# EAGLE design SECDONGL_001 (EAGLE 7.7.0)

## Sheet 1 of 3
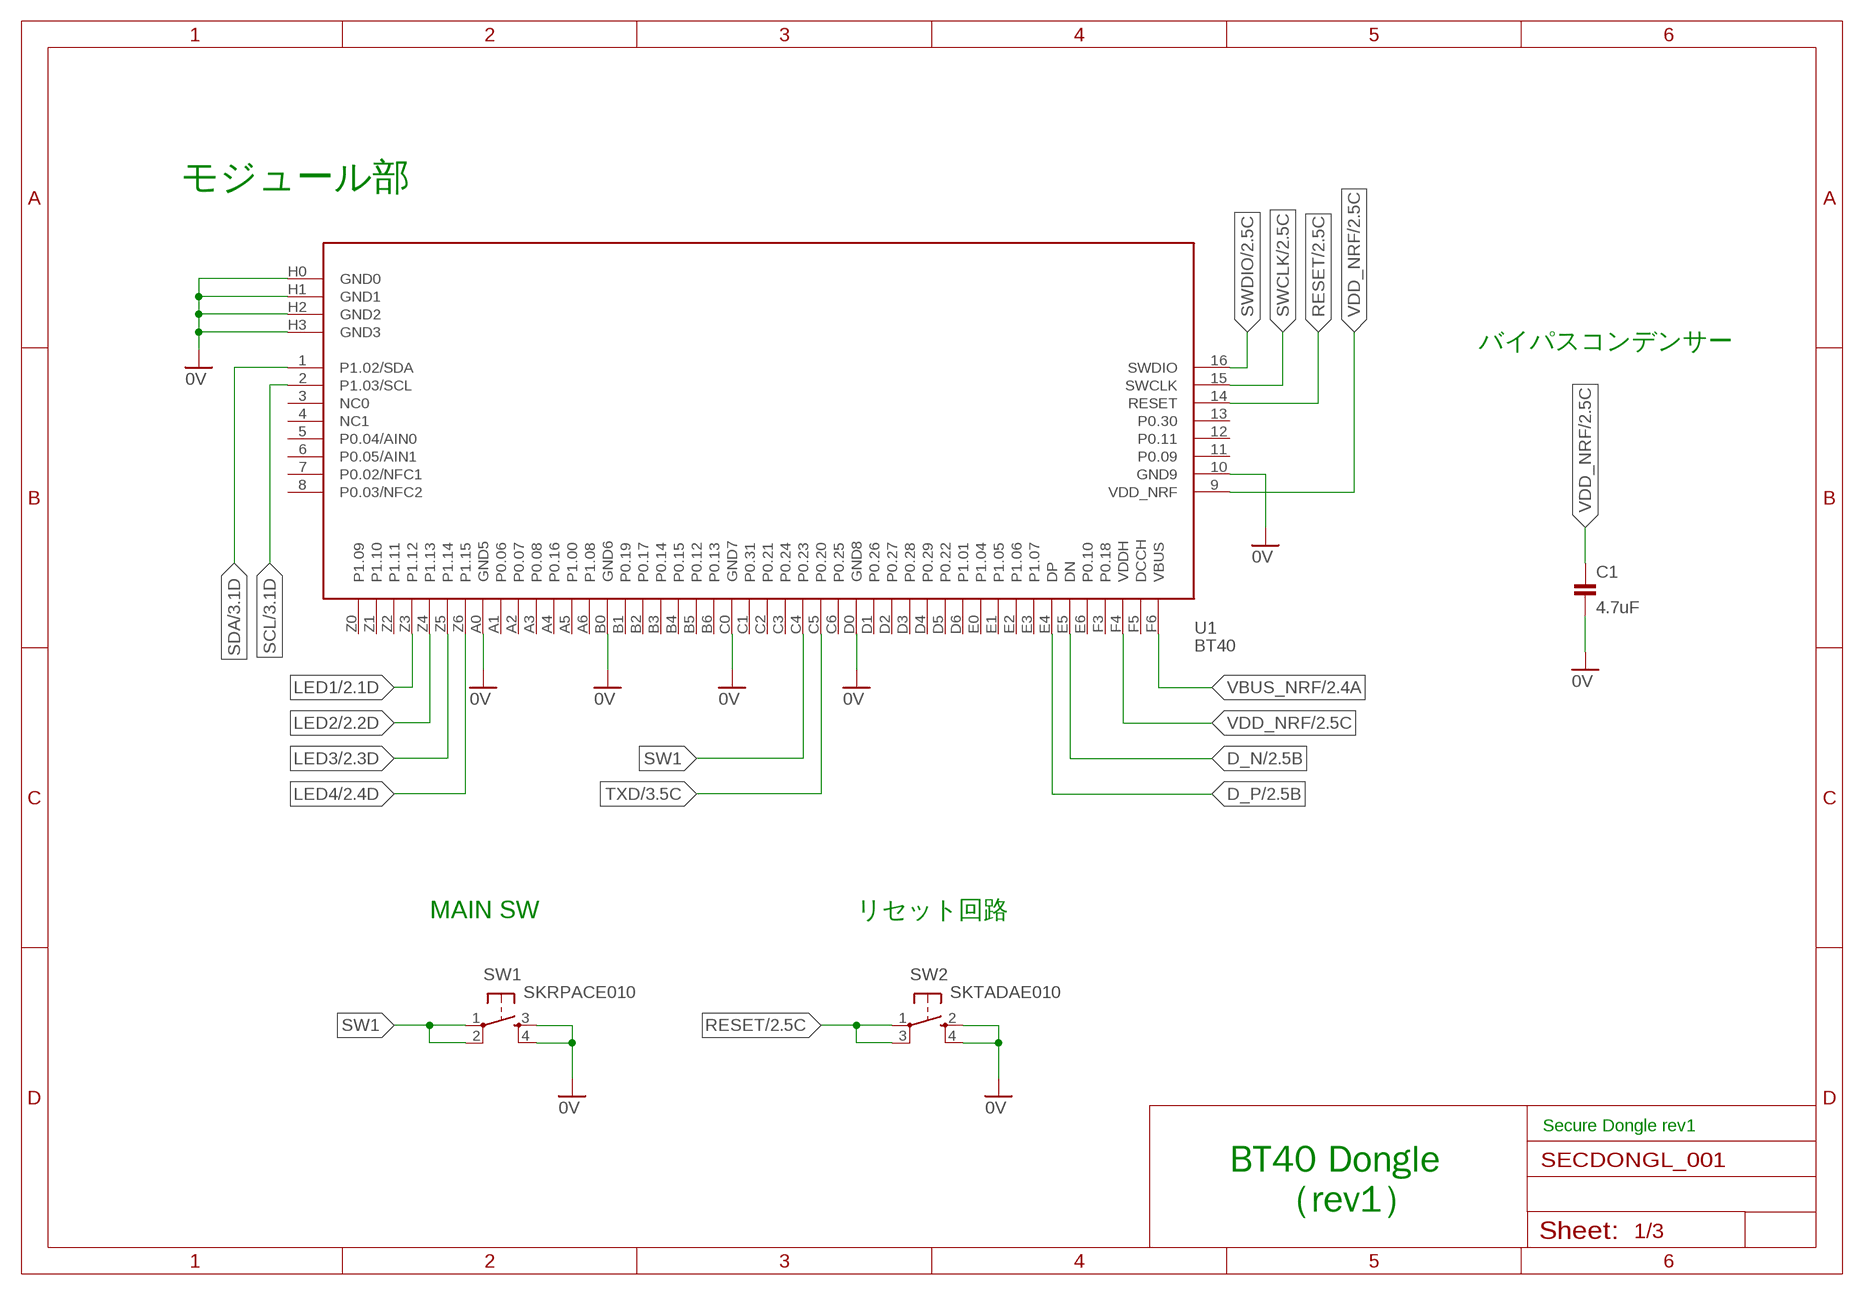
[diagram p0: schematic, sheet 1]

### Parts
C1  4.7uF  CAP_0603  [C0603K]
SW1  SKRPACE010  [SKRPACE010]
SW2  SKTADAE010  [SKTADAE010]
U1  BT40  [BM40-B_1PRIMARY]

### Nets
0V: C1.2 SW1.3(S) SW1.4(S1) SW2.2(S) SW2.4(S1) U1.10(GND9) U1.A0(GND5) U1.B0(GND6) U1.C0(GND7) U1.D0(GND8) U1.H0(GND0) U1.H1(GND1) U1.H2(GND2) U1.H3(GND3) ; also sheet 2,3
D_N: U1.E5(DN) ; also sheet 2
D_P: U1.E4(DP) ; also sheet 2
LED1: U1.Z3(P1.12) ; also sheet 2
LED2: U1.Z4(P1.13) ; also sheet 2
LED3: U1.Z5(P1.14) ; also sheet 2
LED4: U1.Z6(P1.15) ; also sheet 2
RESET: SW2.1(P) SW2.3(P1) U1.14(RESET) ; also sheet 2
SCL: U1.2(P1.03/SCL) ; also sheet 3
SDA: U1.1(P1.02/SDA) ; also sheet 3
SW1: SW1.1(P) SW1.2(P1) U1.C4(P0.23)
SWCLK: U1.15(SWCLK) ; also sheet 2
SWDIO: U1.16(SWDIO) ; also sheet 2
TXD: U1.C5(P0.20) ; also sheet 3
VBUS_NRF: U1.F6(VBUS) ; also sheet 2,3
VDD_NRF: C1.1 U1.9(VDD_NRF) U1.F4(VDDH) ; also sheet 2,3
Unconnected: U1.3(NC0) U1.4(NC1) U1.5(P0.04/AIN0) U1.6(P0.05/AIN1) U1.7(P0.02/NFC1) U1.8(P0.03/NFC2) U1.11(P0.09) U1.12(P0.11) U1.13(P0.30) U1.A1(P0.06) U1.A2(P0.07) U1.A3(P0.08) U1.A4(P0.16) U1.A5(P1.00) U1.A6(P1.08) U1.B1(P0.19) U1.B2(P0.17) U1.B3(P0.14) U1.B4(P0.15) U1.B5(P0.12) U1.B6(P0.13) U1.C1(P0.31) U1.C2(P0.21) U1.C3(P0.24) U1.C6(P0.25) U1.D1(P0.26) U1.D2(P0.27) U1.D3(P0.28) U1.D4(P0.29) U1.D5(P0.22) U1.D6(P1.01) U1.E0(P1.04) U1.E1(P1.05) U1.E2(P1.06) U1.E3(P1.07) U1.E6(P0.10) U1.F3(P0.18) U1.F5(DCCH) U1.Z0(P1.09) U1.Z1(P1.10) U1.Z2(P1.11)

### Notes on the sheet
- モジュール部
- バイパスコンデンサー
- MAIN SW | リセット回路
- Secure Dongle rev1
- BT40 Dongle
      （rev1）

## Sheet 2 of 3
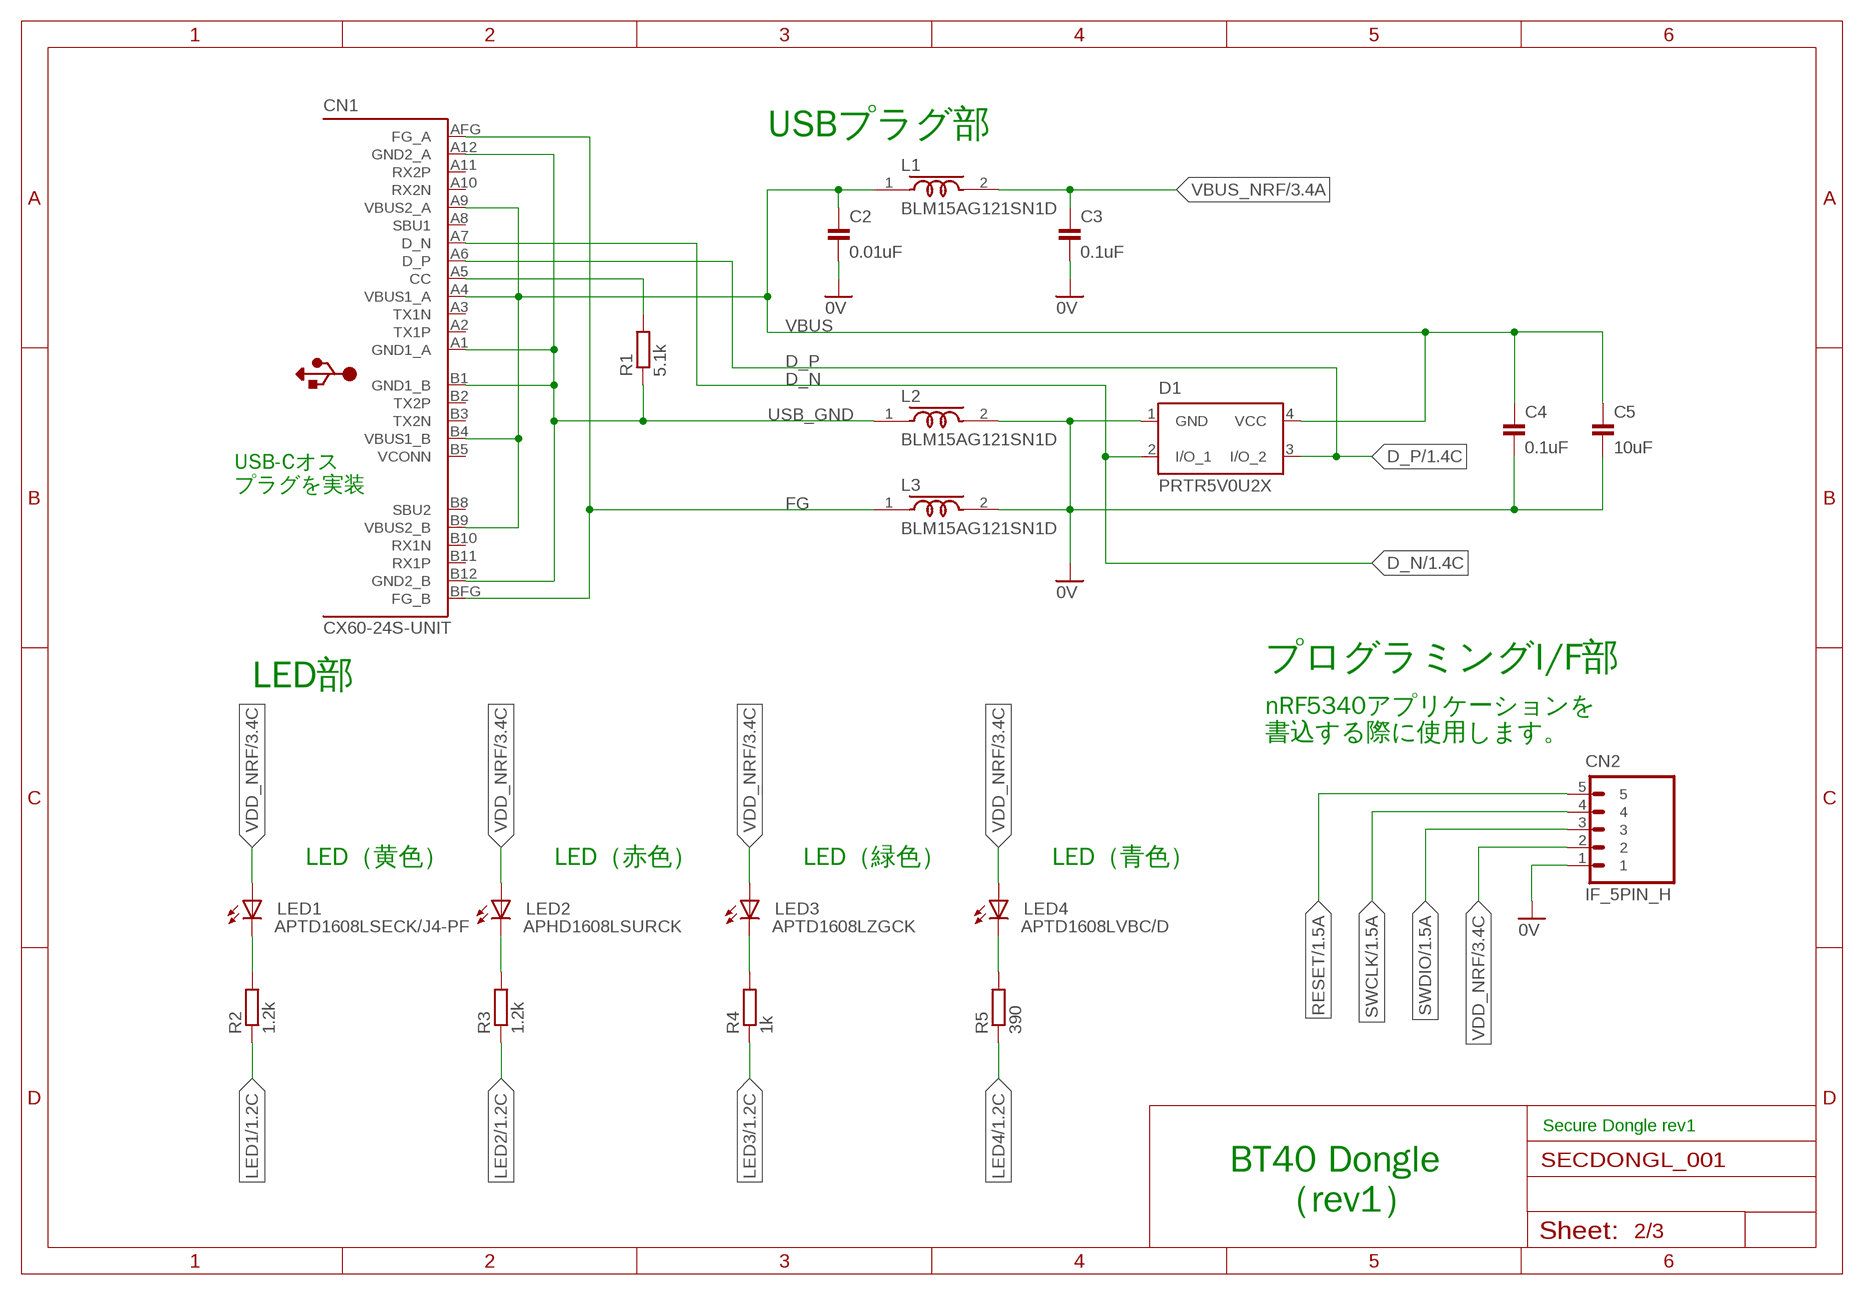
[diagram p1: schematic, sheet 2]

### Parts
C2  0.01uF  CAP_0402K  [C0402K]
C3  0.1uF  CAP_0402K  [C0402K]
C4  0.1uF  CAP_0402K  [C0402K]
C5  10uF  CAP_0603  [C0603K]
CN1  CX60-24S-UNIT  [CX60-24S-UNIT]
CN2  IF_5PIN_H  [HEADER_5PIN]
D1  PRTR5V0U2X  [SOT143B]
L1  BLM15AG121SN1D  [C0402K]
L2  BLM15AG121SN1D  [C0402K]
L3  BLM15AG121SN1D  [C0402K]
LED1  APTD1608LSECK/J4-PF  [APTD1608]
LED2  APHD1608LSURCK  [APTD1608]
LED3  APTD1608LZGCK  [APTD1608]
LED4  APTD1608LVBC/D  [APTD1608]
R1  5.1k  RESISTOR_0402  [R0402]
R2  1.2k  RESISTOR_0402  [R0402]
R3  1.2k  RESISTOR_0402  [R0402]
R4  1k  RESISTOR_0402  [R0402]
R5  390  RESISTOR_0402  [R0402]

### Nets
0V: C2.2 C3.2 C4.2 C5.2 CN2.1 D1.1(GND) L2.2 L3.2 ; also sheet 1,3
D_N: CN1.A7(D_N) D1.2(I/O_1) ; also sheet 1
D_P: CN1.A6(D_P) D1.3(I/O_2) ; also sheet 1
FG: CN1.AFG(FG_A) CN1.BFG(FG_B) L3.1
LED1: R2.1 ; also sheet 1
LED2: R3.1 ; also sheet 1
LED3: R4.1 ; also sheet 1
LED4: R5.1 ; also sheet 1
N$1: LED4.C R5.2
N$2: CN1.A5(CC) R1.2
N$6: LED3.C R4.2
N$7: LED2.C R3.2
N$8: LED1.C R2.2
RESET: CN2.5 ; also sheet 1
SWCLK: CN2.4 ; also sheet 1
SWDIO: CN2.3 ; also sheet 1
USB_GND: CN1.A1(GND1_A) CN1.A12(GND2_A) CN1.B1(GND1_B) CN1.B12(GND2_B) L2.1 R1.1
VBUS: C2.1 C4.1 C5.1 CN1.A4(VBUS1_A) CN1.A9(VBUS2_A) CN1.B4(VBUS1_B) CN1.B9(VBUS2_B) D1.4(VCC) L1.1
VBUS_NRF: C3.1 L1.2 ; also sheet 1,3
VDD_NRF: CN2.2 LED1.A LED2.A LED3.A LED4.A ; also sheet 1,3
Unconnected: CN1.A2(TX1P) CN1.A3(TX1N) CN1.A8(SBU1) CN1.A10(RX2N) CN1.A11(RX2P) CN1.B2(TX2P) CN1.B3(TX2N) CN1.B5(VCONN) CN1.B8(SBU2) CN1.B10(RX1N) CN1.B11(RX1P)

### Notes on the sheet
- USBプラグ部
- USB-Cオス
  プラグを実装
- プログラミングI/F部
- LED部
- nRF5340アプリケーションを
  書込する際に使用します。
- LED（黄色） | LED（赤色） | LED（緑色） | LED（青色）
- Secure Dongle rev1
- BT40 Dongle
      （rev1）

## Sheet 3 of 3
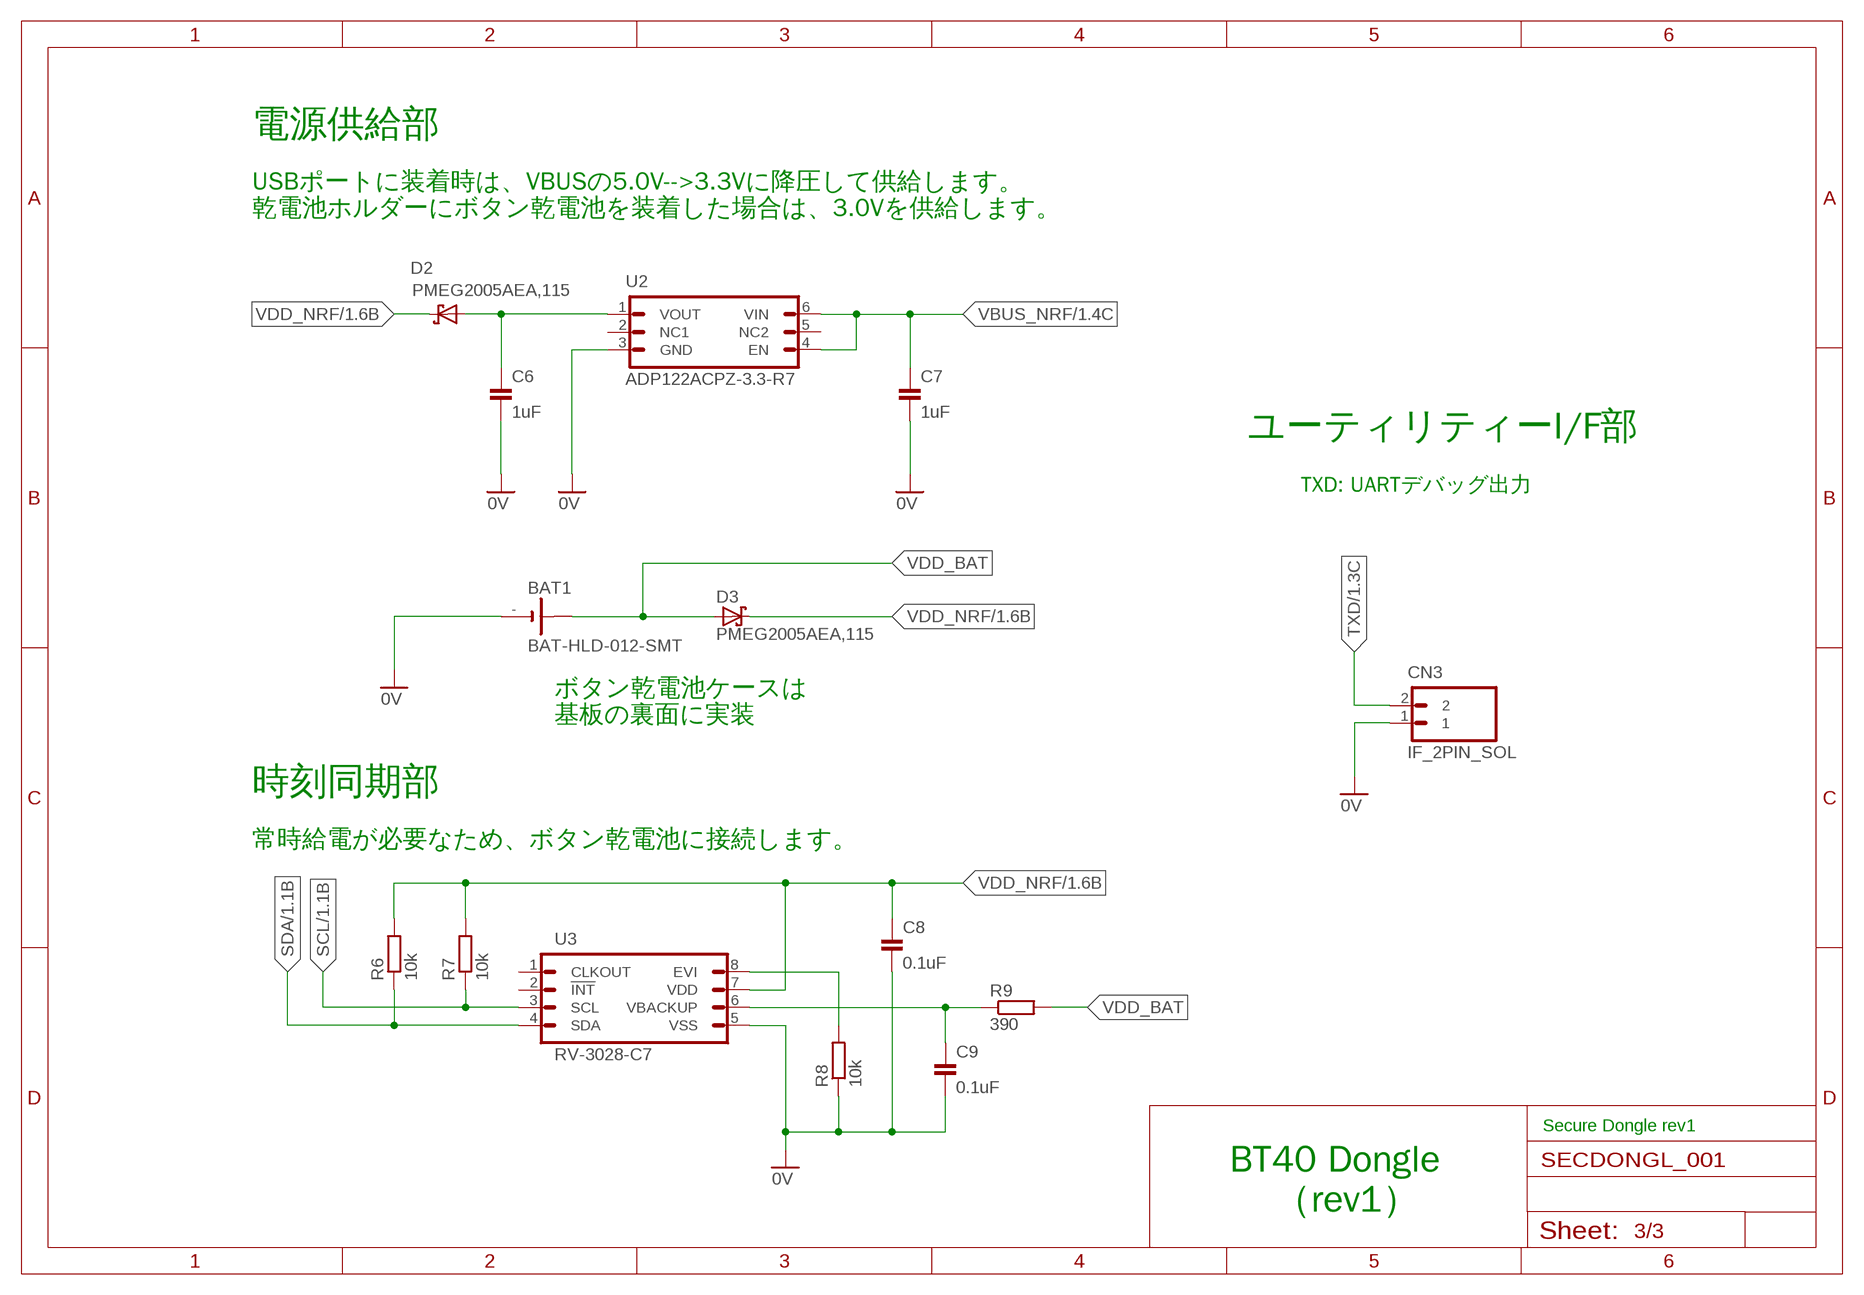
[diagram p2: schematic, sheet 3]

### Parts
BAT1  BAT-HLD-012-SMT  [BAT-HLD-012-SMT]
C6  1uF  CAP_0603  [C0603K]
C7  1uF  CAP_0603  [C0603K]
C8  0.1uF  CAP_0402K  [C0402K]
C9  0.1uF  CAP_0402K  [C0402K]
CN3  IF_2PIN_SOL  [SOLPAD_2PIN]
D2  PMEG2005AEA,115  [SOD323-W]
D3  PMEG2005AEA,115  [SOD323-W]
R6  10k  RESISTOR_0402  [R0402]
R7  10k  RESISTOR_0402  [R0402]
R8  10k  RESISTOR_0402  [R0402]
R9  390  RESISTOR_0402  [R0402]
U2  ADP122ACPZ-3.3-R7  [6-LFCSP_UD]
U3  RV-3028-C7  [SON-8]

### Nets
0V: BAT1.- C6.2 C7.2 C8.2 C9.2 CN3.1 R8.1 U2.3(GND) U3.5(VSS) ; also sheet 1,2
N$3: C6.1 D2.A U2.1(VOUT)
N$4: C9.1 R9.1 U3.6(VBACKUP)
N$5: R8.2 U3.8(EVI)
SCL: R7.1 U3.3(SCL) ; also sheet 1
SDA: R6.1 U3.4(SDA) ; also sheet 1
TXD: CN3.2 ; also sheet 1
VBUS_NRF: C7.1 U2.4(EN) U2.6(VIN) ; also sheet 1,2
VDD_BAT: BAT1.+@2(+) D3.A R9.2
VDD_NRF: C8.1 D2.C D3.C R6.2 R7.2 U3.7(VDD) ; also sheet 1,2
Unconnected: U2.2(NC1) U2.5(NC2) U3.1(CLKOUT) U3.2(!INT!)

### Notes on the sheet
- 電源供給部
- USBポートに装着時は、VBUSの5.0V-->3.3Vに降圧して供給します。
  乾電池ホルダーにボタン乾電池を装着した場合は、3.0Vを供給します。
- ユーティリティーI/F部
- TXD: UARTデバッグ出力
- ボタン乾電池ケースは
  基板の裏面に実装
- 時刻同期部
- 常時給電が必要なため、ボタン乾電池に接続します。
- Secure Dongle rev1
- BT40 Dongle
      （rev1）

## Library data of the parts
BAT1 = Connectors:BAT-HLD-012-SMT: ボタン電池ホルダー(CR1216/1225)
C1-C9 = Parts:CAP: コンデンサー
CN1 = Connectors:CX60-24S-UNIT: USB Type-C(TM) plug
CN2 = Connectors:IF_5PIN: 5-pin インターフェース
CN3 = Connectors:IF_2PIN: 2-pin インターフェース
D1 = Parts:PRTR5V0U2X: ESD protection diode
D2 D3 = Parts:PMEG2005: ショットキーダイオード If - 順電流: 500 mA Vrrm - 繰返し逆電圧: 20 V Vf - 順電圧: 0.39 V Ifsm - 順方向サージ電流: 10 A 最低動作温度: - 65 C 最高動作温度: + 150 C
L1-L3 = Parts:BLM15AG: フェライトビーズ EMIFIL®
LED1 LED3 LED4 = Parts:APTD1608: 発光ダイオード
LED2 = Parts:APHD1608: 発光ダイオード
R1-R9 = Parts:RESISTOR: 抵抗器
SW1 = Parts:SKRPACE010: 表面実装用タクトスイッチ ４．２×３．２ｍｍ小型重作動力タイプ ・作動力：２．５５Ｎ ・操作方向：垂直 ・移動量：０．２ｍｍ ・動作寿命：５０，０００ｃｙｃｌｅｓ （５ｍＡ ５ＶＤＣ） ・初期接触抵抗：最大５００ｍΩ
SW2 = Parts:SKTADAE010: 表面実装用タクトスイッチ 2.6×1.6ｍｍ小型重作動力タイプ ・作動力：2.4 N ・操作方向：垂直 ・移動量：0.11 mm ・定格：50 mA 12 VDC
U1 = Modules:BT40: BLE 5.2, 802.15.4 Modules ・nRF5340 QKAA, dual core ARM® Cortex M33 ・128/64 MHz Cortex M33 with FPU and DSP instructions ・1MB flash, 512KB RAM ・DC-DC converter, inductors for VDD, VDDH on board. ・Direct powered by Lithium batteries or USB supply (up to 5.5V)
U2 = ICs:ADP122: Low Quiescent Current, CMOS Linear Regulator Input voltage supply range: 2.3 V to 5.5 V 300 mA maximum output current Very low dropout voltage: 85 mV at 300 mA load Low quiescent current: 45 μA at no load
U3 = ICs:RV-3028-C7: Extreme Low Power RTC Module Supply Voltage: 1.2 V 〜 5.5 V Operating Temperature: - 40 C 〜 + 85 C 3.2 mm x 1.5 mm

## Board
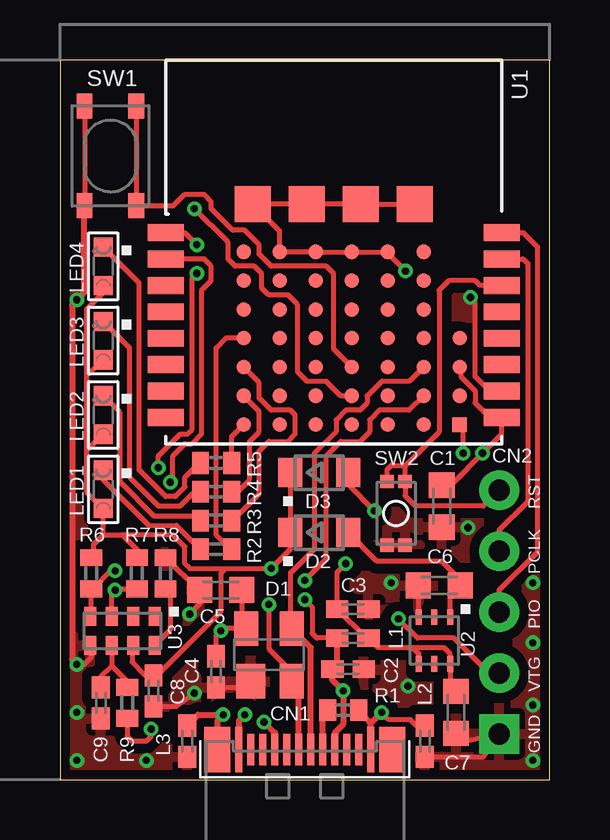
[diagram p3: board, top side]
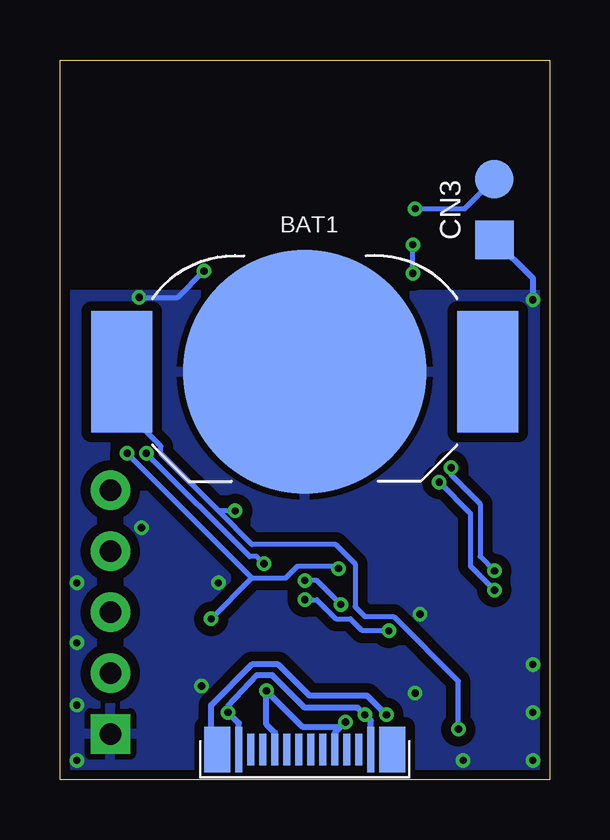
[diagram p4: board, bottom side, seen from below]

Size 20.4 x 30 mm. Coordinates in mm from the lower left corner, seen from the top.
Outline: 0,0 20.4,0 20.4,30 0,30 0,0
Copper layers (1*16): Top 0.035mm / dielectric 1.5mm / Bottom 0.035mm
Design rules "SeeedStudio_2layer_DRU_no_angle_20140221 *": minimum track width 6mil, minimum drill 0.3mm, track to track 6mil, track to pad 6mil, pad to pad 6mil, via to via 6mil, smd to smd 0mil, copper to edge 10mil, drill to drill 10mil, minimum pad ring 10mil, minimum via ring 6mil, stop-mask expansion 2mil, vias tented up to drill 100mil, thermal gap 10mil

### Footprints (pad centres in the part's own frame; a part is rotated, then mirrored left to right if it is on the bottom)
BAT-HLD-012-SMT = smd 2.54 x 5.08: +@1 -7.62,0; +@2 7.62,0 | smd 10.16 x 10.16: - 0,0
C0603K = smd 1.05 x 1.08: 1 -0.875,0; 2 0.875,0
C0402K = smd 0.925 x 0.74: 1 -0.65,0; 2 0.65,0
CX60-24S-UNIT = smd 0.28 x 1.9: A1 2.75,0; A12 -2.75,0 | smd 0.28 x 1.3: A2 2.25,0; A3 1.75,0; A4 1.25,0; A5 0.75,0; A6 0.25,0; A7 -0.25,0; A8 -0.75,0; A9 -1.25,0; A10 -1.75,0; A11 -2.25,0 | smd 1.08 x 1.9: ADUM 3.64,0; AFG -3.64,0 | smd 0.28 x 1.9 bottom: B1 -2.75,0; B12 2.75,0 | smd 0.28 x 1.3 bottom: B2 -2.25,0; B3 -1.75,0; B4 -1.25,0; B5 -0.75,0; B6 -0.25,0; B7 0.25,0; B8 0.75,0; B9 1.25,0; B10 1.75,0; B11 2.25,0 | smd 1.08 x 1.9 bottom: BDUM -3.64,0; BFG 3.64,0
HEADER_5PIN = drill 0.889 pad 1.651 square: 1 0,0 | drill 0.889 pad 1.651: 2 2.54,0; 3 5.08,0; 4 7.62,0; 5 10.16,0
SOLPAD_2PIN = smd 1.6 x 1.6: 1 0,0; 2 2.54,0
SOT143B = smd 1.2 x 1.44: 1 -0.75,-1.1 | smd 1 x 1.44: 2 0.95,-1.1; 3 0.95,1.1; 4 -0.95,1.1
SOD323-W = smd 1 x 1.2: A 1.2,0; C -1.2,0
APTD1608 = smd 0.8 x 0.8: A -0.8,0; C 0.8,0
R0402 = smd 0.7 x 0.9: 1 -0.65,0; 2 0.65,0
SKRPACE010 = smd 1.05 x 0.65: 1 -2.075,1.075; 2 2.075,1.075; 3 -2.075,-1.075; 4 2.075,-1.075
SKTADAE010 = smd 0.55 x 0.55: 1 -1.325,0.375; 2 1.325,0.375; 3 -1.325,-0.375; 4 1.325,-0.375
BM40-B_1PRIMARY = smd 1.5 x 0.7: 1 0,8.8; 2 0,7.7; 3 0,6.6; 4 0,5.5; 5 0,4.4; 6 0,3.3; 7 0,2.2; 8 0,1.1; 9 14,1.1; 10 14,2.2; 11 14,3.3; 12 14,4.4; 13 14,5.5; 14 14,6.6; 15 14,7.7; 16 14,8.8 | smd 0.6 x 0.6: A0 4.75,8; A1 4.75,6.8; A2 4.75,5.6; A3 4.75,4.4; A4 4.75,3.2; A5 4.75,2; A6 4.75,0.8; B0 6.25,8; B1 6.25,6.8; B2 6.25,5.6; B3 6.25,4.4; B4 6.25,3.2; B5 6.25,2; B6 6.25,0.8; C0 7.75,8; C1 7.75,6.8; C2 7.75,5.6; C3 7.75,4.4; C4 7.75,3.2; C5 7.75,2; C6 7.75,0.8; D0 9.25,8; D1 9.25,6.8; D2 9.25,5.6; D3 9.25,4.4; D4 9.25,3.2; D5 9.25,2; D6 9.25,0.8; E0 10.75,8; E1 10.75,6.8; E2 10.75,5.6; E3 10.75,4.4; E4 10.75,3.2; E5 10.75,2; E6 10.75,0.8; F3 12.25,4.4; F4 12.25,3.2; F5 12.25,2; F6 12.25,0.8; Z0 3.25,8; Z1 3.25,6.8; Z2 3.25,5.6; Z3 3.25,4.4; Z4 3.25,3.2; Z5 3.25,2; Z6 3.25,0.8 | smd 1.5 x 1.5: H0 3.625,10; H1 5.875,10; H2 8.125,10; H3 10.375,10
6-LFCSP_UD = smd 0.25 x 0.65: 1 -0.65,-0.975; 2 0,-0.975; 3 0.65,-0.975; 4 0.65,0.975; 5 0,0.975; 6 -0.65,0.975
SON-8 = smd 0.5 x 0.8: 1 0.25,0.4; 2 1.15,0.4; 3 2.05,0.4; 4 2.95,0.4; 5 2.95,1.6; 6 2.05,1.6; 7 1.15,1.6; 8 0.25,1.6

### Placement (x,y rotation side)
BAT1  10.2,17 180 bottom
C1  15.9,11.4 270 top
C2  12,4.6 0 top
C3  12.2,7.1 0 top
C4  6.5,4.5 270 top
C5  6.7,7.9 180 top
C6  15.8,8.1 180 top
C7  16.5,2.8 270 top
C8  3.9,3.7 270 top
C9  1.7,3.2 270 top
CN1  10.2,1.25 0 top
CN2  18.3,1.9 90 top
CN3  2.3,22.5 90 bottom
D1  8.7,5.2 0 top
D2  10.8,10.3 0 top
D3  10.8,12.8 0 top
L1  12.2,5.9 0 top
L2  15.2,1.6 270 top
L3  5.3,1.6 270 top
LED1  1.8,12.1 90 top
LED2  1.8,15.2 90 top
LED3  1.8,18.3 90 top
LED4  1.8,21.4 90 top
R1  11.8,2.9 180 top
R2  6.5,9.6 180 top
R3  6.5,10.8 180 top
R4  6.5,12 180 top
R5  6.5,13.2 180 top
R6  1.3,8.6 90 top
R7  3.2,8.6 90 top
R8  4.4,8.6 270 top
R9  2.8,3.2 270 top
SW1  2.1,26 270 top
SW2  14,11.1 270 top
U1  4.4,14 0 top
U2  15.6,5.8 180 top
U3  4.2,7.2 180 top

### Tracks (layer width: path | path; a pad name or v marks a point on that pad's centre or on a via)
0V  (via drill 0.3)
  Top 0.203: U1.H3 U1.H2 U1.H1 U1.H0 9.15,22.88 U1.A0 U1.B0 U1.C0 U1.D0 13.65,21.95 v14.4,21.2 | C8.2 4.85,3.05 v5.6,3.6 | C4.2 7.7,3.85 D1.1 | L2.2 17.65,0.95 CN2.1 16.82,1.6 C7.2 | R8.1 5.75,7.9 C5.2 5.83,7.33 v5.4,6.9 | U2.3 14.95,8.07 C6.2 | U3.5 1.3,5.55 1.3,5.1 1,4.8 v0.7,4.8 | SW2.4 SW2.2 | SW1.3 SW1.4 | U1.10 17.9,16.2 17.3,16.8 17.3,19.9 v17.1,20.1
  Top 0.254: v0.7,4.8 0.5,5 0.5,19.8 v0.7,20 1,20.3 1,23.9 SW1.4
  Bottom 0.203: v17.1,20.1 15.5,20.1 v14.4,21.2
  Bottom 0.254: CN3.1 0.7,20.9 v0.7,20
  other vias: 0.7,0.8 13.8,8.2 0.7,2.8 3.6,0.8 14.5,3.9 19.7,0.8 19.7,3.1 19.7,5.7 17,10.5 19.7,8.2
  pour Bottom (isolate 0.406): -0.8,20.2 21.2,20.2 21.2,-1 -0.8,-1
  pour Top (isolate 0.406): -1.8,20.2 22.2,20.2 22.2,-2 -1.8,-2
D_N  (via drill 0.3, 0.3 pad 0.45)
  Top 0.203: v8.7,7.3 8.7,5.45 9.65,4.5 D1.2 | v10.2,8.3 11.1,9.2 11.1,13.5 11.7,14.1 12.5,14.1 12.9,14.5 12.9,15 13.3,15.4 14.55,15.4 U1.E5
  Top 0.254: CN1.A7 9.95,3.8 D1.2
  Bottom 0.203: v8.7,7.3 9.7,8.3 v10.2,8.3
D_P
  Top 0.203: 9.7,6.35 D1.3 9.6,6.35 9.6,6.45 9.6,8.6 10.6,9.6 10.6,13.6 11.5,14.5 11.5,15 11.9,15.4 12.5,15.4 12.8,15.7 12.8,16 13.4,16.6 14.55,16.6 U1.E4
  Top 0.254: CN1.A6 10.45,5.5 D1.3 | 9.7,6.35 9.6,6.45
FG  (via drill 0.3)
  Top 0.254: CN1.AFG 6.56,2.46 v6.8,2.7 5.75,2.7 L3.1
  Bottom 0.254: v6.8,2.7 7.6,3.5 10,3.5 11.3,4.8 12.4,4.8 14.1,3.1 14.1,1.51 CN1.BFG
LED1
  Top 0.203: R2.1 7.1,9.6 6.5,10.2 6.5,18 6.9,18.4 U1.Z3
LED2
  Top 0.203: R3.1 7.2,10.8 8.3,11.9 8.3,13.7 8.7,14.1 9.5,14.1 9.8,14.4 9.8,15.2 9.6,15.4 8.8,15.4 8.3,15.9 8.3,16.55 U1.Z4
LED3
  Top 0.203: R4.1 7.4,12 7.9,12.5 7.9,14.1 8.3,14.5 8.3,15.35 U1.Z5
LED4
  Top 0.203: R5.1 7.15,14.3 U1.Z6
N$1
  Top 0.203: R5.2 5.8,13.2 5.2,12.6 5.2,12.2 4.8,11.8 4.4,11.8 3.3,12.9 3.3,20.7 LED4.C
N$2
  Top 0.254: CN1.A5 10.95,2.7 R1.2
N$3
  Top 0.203: U2.1 16.25,7.97 C6.1 16.48,8.53 15.9,9.1 13.2,9.1 D2.A
N$4
  Top 0.203: U3.6 2.15,4.75 | R9.1 2.8,4.1 2.15,4.75 | C9.1 1.7,4.3 2.15,4.75
N$5
  Top 0.203: U3.8 4.6,6.25 4.6,7.75 R8.2
N$6
  Top 0.203: R4.2 5.5,11.9 5,11.4 4.1,11.4 2.9,12.6 2.9,18 LED3.C
N$7
  Top 0.203: R3.2 5.65,11 3.9,11 2.5,12.4 2.5,15.3 LED2.C
N$8
  Top 0.203: R2.2 4.85,10.6 3.7,10.6 1.8,12.5 LED1.C
RESET
  Top 0.203: CN2.5 17.64,11.4 14.8,11.4 14.38,11.82 SW2.1 14.38,13.07 | 14.38,13.07 15.8,14.5 15.8,20.4 16.2,20.8 17.3,20.8 17.5,20.6 U1.14 | SW2.3 13.62,12.93 13.8,13.1 14.35,13.1 14.38,13.07
SCL  (via drill 0.3)
  Top 0.203: U3.3 2.15,7.75 v2.3,7.9 2.35,7.95 R7.1 | v4.6,12.4 4.7,12.5 4.7,13.5 5.2,14 5.5,14 5.9,14.4 5.9,20.4 6.3,20.8 6.3,21.4 6,21.7 U1.2
  Bottom 0.203: v4.6,12.4 3.3,11.1 3.3,8.9 v2.3,7.9
SDA  (via drill 0.3)
  Top 0.203: v2.3,8.7 2.1,8.7 1.4,8 R6.1 1.3,6.85 U3.4 | v4.1,13 4.1,13.5 5,14.4 5.3,14.4 5.5,14.6 5.5,20.9 v5.7,21.1 | U1.1 5.2,22.8 v5.7,22.3
  Bottom 0.203: v2.3,8.7 2.9,9.3 2.9,11.5 4.1,12.7 v4.1,13 | v5.7,21.1 v5.7,22.3
SW1
  Top 0.203: SW1.1 SW1.2 4.72,23.93 5.2,24.4 6,24.4 6.3,24.1 6.3,23.8 7.2,22.9 7.7,22.9 8.3,22.3 8.3,21.9 8.8,21.4 11.1,21.4 11.4,21.1 11.4,17.95 U1.C4
SWCLK
  Top 0.203: CN2.4 18.3,10.4 19.5,11.6 19.5,21.5 19.3,21.7 U1.15
SWDIO
  Top 0.203: U1.16 19.3,22.8 19.9,22.2 19.9,9.5 18.3,7.9 CN2.3
TXD  (via drill 0.3)
  Top 0.203: U1.C5 11.7,16 11.1,16.6 10.3,16.6 9.9,17 9.9,19.8 9.5,20.2 8.7,20.2 8.4,20.5 8.4,21.1 8.1,21.4 7.3,21.4 7,21.7 7,22.4 v5.6,23.8
  Bottom 0.203: v5.6,23.8 3.54,23.8 CN3.2
USB_GND  (via drill 0.3)
  Top 0.203: L2.1 14.85,2.25 14.6,2.5 13.7,2.5 v13.4,2.8
  Top 0.254: CN1.A1 12.95,2.35 | 12.95,2.35 v13.4,2.8 | R1.1 12.95,2.35 | v7.7,2.7 7.45,2.45 CN1.A12
  Bottom 0.254: CN1.A1 12.95,2.35 v13.4,2.8 13.4,3.05 12.2,4.35 11.55,4.35 10.2,3 8,3 v7.7,2.7 7.45,2.45 CN1.A12
VBUS  (via drill 0.3)
  Top 0.203: 7.65,6.2 D1.4 | C5.1 7.58,6.47 D1.4 | C4.1 6.5,6 v6.7,6.2 6.8,6.3 D1.4 | v10.2,7.5 10.5,7.2 10.5,6.1 10.7,5.9 L1.1
  Top 0.254: CN1.B9 11.45,1.95 11.8,2.3 v11.8,3.7 11.35,4.15 C2.1 11.55,4.8 L1.1 | CN1.B4 8.95,1.95 v8.5,2.4
  Bottom 0.203: v10.2,7.5 9.7,7.5 8.9,6.7 8.3,6.7 7.8,6.2 v6.7,6.2
  Bottom 0.24: CN1.B9 11.45,1.95 11.8,2.3 v11.8,3.7
  Bottom 0.254: CN1.B4 8.95,1.95 8.7,2.2 | v11.8,3.7 10.3,2.2 8.7,2.2 | 8.7,2.2 v8.5,2.4
VBUS_NRF  (via drill 0.3)
  Top 0.203: 16.43,3.6 C7.1 16.25,3.92 U2.6 16.25,5.25 16,5.5 14.7,5.5 | v11.9,9 11.55,8.65 C3.1 12.75,5.9 L1.2 13.25,5.5 14.7,5.5 | U2.4 14.95,5.25 14.7,5.5 | v16.8,13.6 16.8,14.65 U1.F6
  Bottom 0.203: v11.9,9 12.2,9.3 12.5,9.3 v16.8,13.6
VDD_BAT  (via drill 0.3)
  Top 0.203: R9.2 2.8,1.8 3,1.6 3.6,1.6 3.8,1.8 v3.8,2.1 | D3.A 12,12.3 v13.1,11.2
  Bottom 0.203: v3.8,2.1 3.8,4.1 6.5,6.8 7.7,6.8 8.1,7.2 8.1,9 8.9,9.8 12.4,9.8 13.75,11.15 | 13.75,11.15 16.2,13.6 16.2,13.9 17.6,15.3 17.6,16.78 BAT1.+@2 | v13.1,11.2 13.7,11.2 13.75,11.15
VDD_NRF  (via drill 0.3)
  Top 0.203: 2.6,10.2 3.2,9.6 R7.2 | U3.7 3,5.55 3,4.9 3.55,4.35 C8.1 4.05,4.35 6.7,7 6.7,8.6 6.9,8.8 | 1.8,10.2 1.4,9.8 1.4,9.35 R6.2 | 1.8,10.2 2.6,10.2 | 2.6,10.2 4.7,10.2 5.2,9.7 5.2,9 5.4,8.8 6.9,8.8 | CN2.2 17.86,4.44 16.4,5.9 14.9,5.9 v14.1,6.7 | D3.C D2.C 9.6,9.6 v8.8,8.8 6.9,8.8 | C1.1 16,12.38 16.38,12.38 v17.6,13.6 18.4,14.4 U1.9 17.9,15.1 17.3,15.7 17.3,16.2 16.7,16.8 16.7,17.15 U1.F4 | LED4.A 1.8,20.3 1.1,19.6 1.1,16.8 | 1.8,10.2 LED1.A 1.1,12 1.1,13.7 | 1.1,16.8 1.1,13.7 | LED2.A 1.1,13.7 | LED3.A 1.1,16.8
  Bottom 0.203: 12.4,8.4 11,8.4 10.5,8.9 8.9,8.9 v8.8,8.8 | 12.4,8.4 v17.6,13.6 | v14.1,6.7 12.4,8.4

### Text on the board
tPlace: RST | PCLK | PIO | VTG | GND